# EasyEDA schematic 4 HF Upconverter (TH)_ Mixer with filters.json
TITLE: HF Upconverter (TH): Mixer with filters; REV: 3.4.EE; Date: 2018-03-02; Sheet: 1/1; Drawn By: IgrikXD
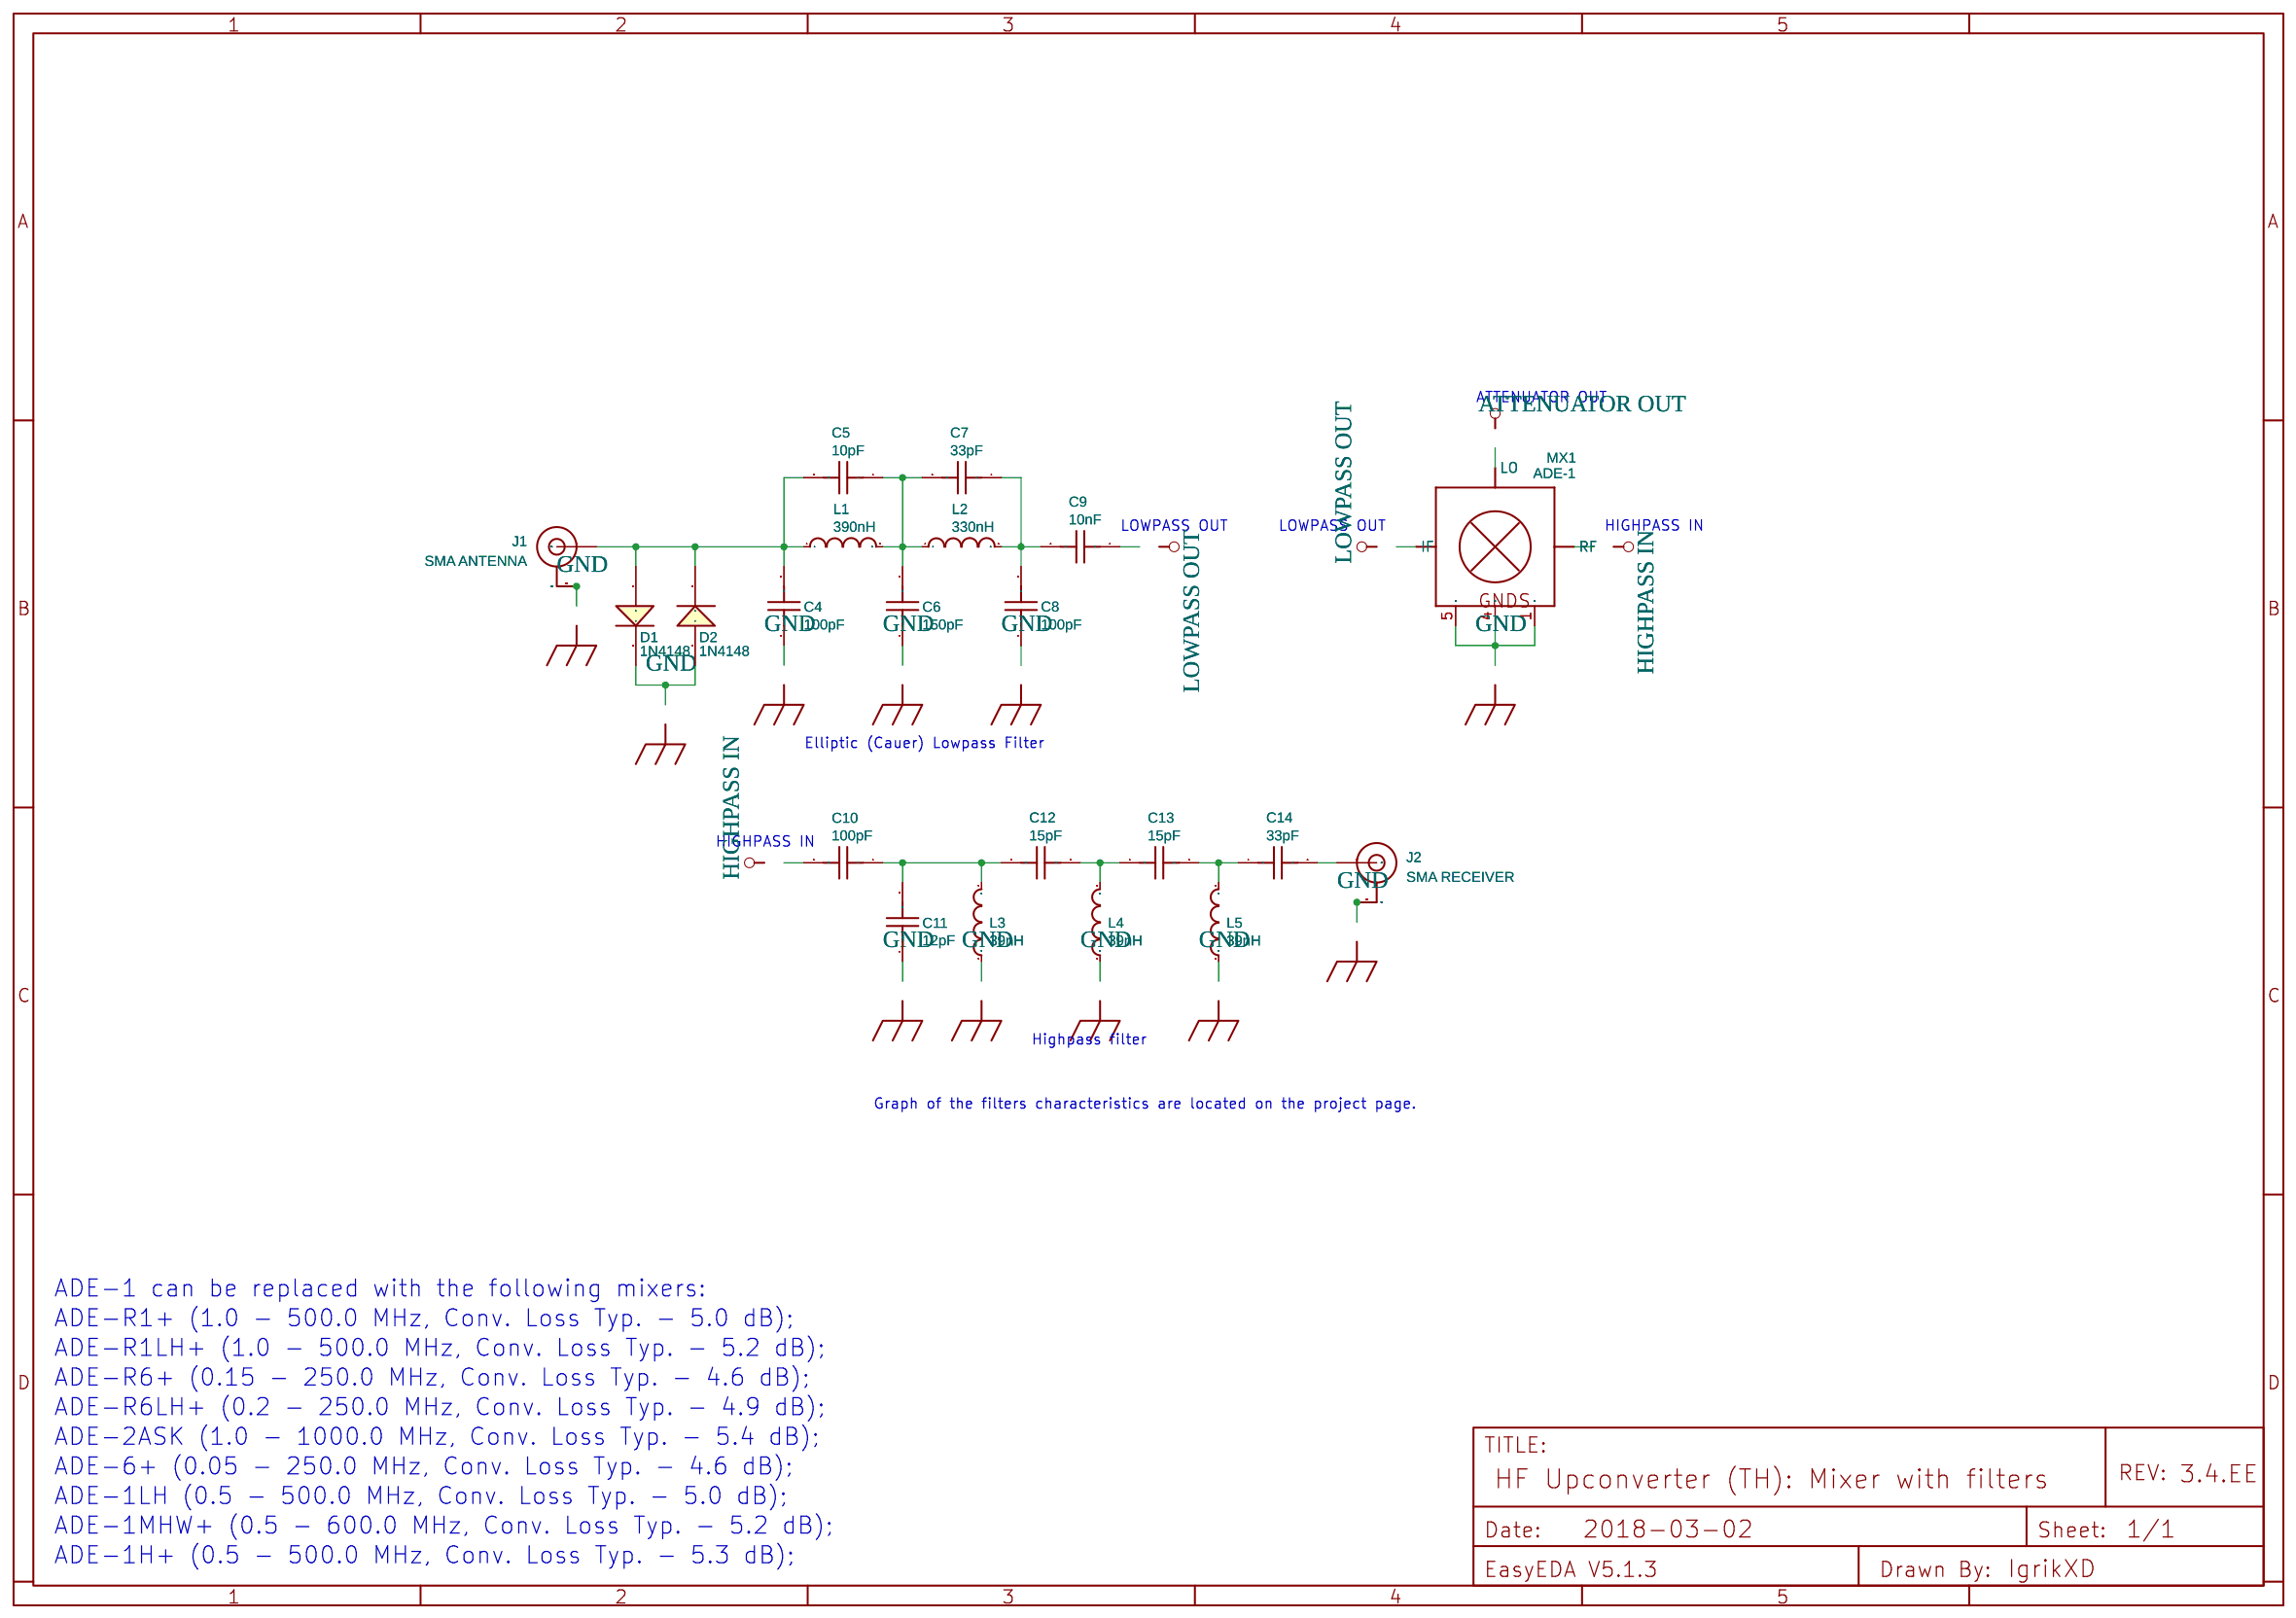
[diagram p0: schematic sheet]

## Parts
C4  100pF  [RAD-0.2]
C5  10pF  [RAD-0.2]
C6  150pF  [RAD-0.2]
C7  33pF  [RAD-0.2]
C8  100pF  [RAD-0.2]
C9  10nF  [RAD-0.2]
C10  100pF  [RAD-0.2]
C11  12pF  [RAD-0.2]
C12  15pF  [RAD-0.2]
C13  15pF  [RAD-0.2]
C14  33pF  [RAD-0.2]
D1  1N4148  [DO-35]
D2  1N4148  [DO-35]
J1  SMA ANTENNA  [SMA-EDGE]
J2  SMA RECEIVER  [SMA-EDGE]
L1  390nH  [AXIAL-0.4]
L2  330nH  [AXIAL-0.4]
L3  39nH  [AXIAL-0.4]
L4  39nH  [AXIAL-0.4]
L5  39nH  [AXIAL-0.4]
MX1  ADE-1  [CD636]

## Library data of the parts
C4 C8 C10 = Capacitor: Manufacturer Part: CC4-0805-CG -50V-100pF-J; Supplier: LCSC; LCSC: C123146; Manufacturer: TORCH
C5 = Capacitor: Manufacturer Part: CC4-0805-CG -50V-10pF-J; Supplier: LCSC; LCSC: C123155; Manufacturer: TORCH
C6 = Capacitor: Manufacturer Part: CC4-0805N151J500PF3; Supplier: LCSC; LCSC: C128041; Manufacturer: FH
C7 C14 = Capacitor: Manufacturer Part: CC4-0805N330J500F3; Supplier: LCSC; LCSC: C94712; Manufacturer: FH
C9 = Capacitor: Manufacturer Part: CT4-0805B103K500F3; Supplier: LCSC; LCSC: C94713; Manufacturer: FH
C11 = Capacitor: Supplier: LCSC
C12 C13 = Capacitor: Manufacturer Part: CC4-0805-CG -50V-15pF-J; Supplier: LCSC; LCSC: C123158; Manufacturer: TORCH
D1 D2 = -: LCSC: C85687; Supplier: LCSC; Manufacturer: MCC; Manufacturer Part: 1N4148-TP
J1 J2 = -: SMA Antenna Connector; catid: 20; Contributor: Pinoccio; Manufacturer Part: CON-SMA-EDGE-S; Supplier: Digi-Key; Digi-Key: CON-SMA-EDGE-S-ND; Manufacturer: RF Solutions
L1 = Inductor: Manufacturer Part: NOT DEFINED; Supplier: Handmade; Handmade: Wire Ø0.25mm., coil Ø2.5mm., windings 16
L2 = Inductor: Manufacturer Part: NOT DEFINED; Supplier: Handmade; Handmade: Wire Ø0.25mm., coil Ø2.5mm., windings 14
L3 L4 = Inductor: Manufacturer Part: NOT DEFINED; Supplier: Handmade; Handmade: Wire Ø0.5mm., coil Ø2.5mm., windings 4.
L5 = Inductor: Manufacturer Part: NOT DEFINED; Supplier: LCSC; LCSC: Wire Ø0.5mm., coil Ø2.5mm., windings 4.
MX1 = -: catid: 20; Manufacturer Part: NOT DEFINED; Supplier: Mini-Circuits; Mini-Circuits: ADE-1+; Manufacturer: Mini Circuits

## Nets
GND: C4.1 C6.1 C8.1 C11.1 D1.2(K) D2.1(A) J1.GND@0(GND) J1.GND@1(GND) J1.GND@2(GND) J1.GND@3(GND) J2.GND@0(GND) J2.GND@1(GND) J2.GND@2(GND) J2.GND@3(GND) L3.1 L4.1 L5.1 MX1.1(GND) MX1.4(GND) MX1.5(GND)
ATTENUATOR OUT: MX1.6(LO)
HIGHPASS IN: C10.2 MX1.3(RF)
LOWPASS OUT: C9.1 MX1.2(IF)
Net-(C4-2): C4.2 C5.2 D1.1(A) D2.2(K) J1.SIG(SIGNAL) L1.1
Net-(C5-1): C5.1 C6.2 C7.2 L1.2 L2.1
Net-(C7-1): C7.1 C8.2 C9.2 L2.2
Net-(C10-1): C10.1 C11.2 C12.1 L3.2
Net-(C12-2): C12.2 C13.1 L4.2
Net-(C13-2): C13.2 C14.1 L5.2
Net-(C14-2): C14.2 J2.SIG(SIGNAL)

## Notes on the sheet
- ATTENUATOR OUT
- LOWPASS OUT
- LOWPASS OUT
- HIGHPASS IN
- Elliptic (Cauer) Lowpass Filter
- HIGHPASS IN
- Highpass filter
- Graph of the filters characteristics are located on the project page.
- ADE-1 can be replaced with the following mixers:
- ADE-R1+ (1.0 - 500.0 MHz, Conv. Loss Typ. - 5.0 dB);
- ADE-R1LH+ (1.0 - 500.0 MHz, Conv. Loss Typ. - 5.2 dB);
- ADE-R6+ (0.15 - 250.0 MHz, Conv. Loss Typ. - 4.6 dB);
- ADE-R6LH+ (0.2 - 250.0 MHz, Conv. Loss Typ. - 4.9 dB);
- ADE-2ASK (1.0 - 1000.0 MHz, Conv. Loss Typ. - 5.4 dB);
- ADE-6+ (0.05 - 250.0 MHz, Conv. Loss Typ. - 4.6 dB);
- ADE-1LH (0.5 - 500.0 MHz, Conv. Loss Typ. - 5.0 dB);
- ADE-1MHW+ (0.5 - 600.0 MHz, Conv. Loss Typ. - 5.2 dB);
- ADE-1H+ (0.5 - 500.0 MHz, Conv. Loss Typ. - 5.3 dB);
